# EasyEDA Pro project ProPrj_ESP32SmartClock_2025-03-27.epro

# Schematic Schematic1
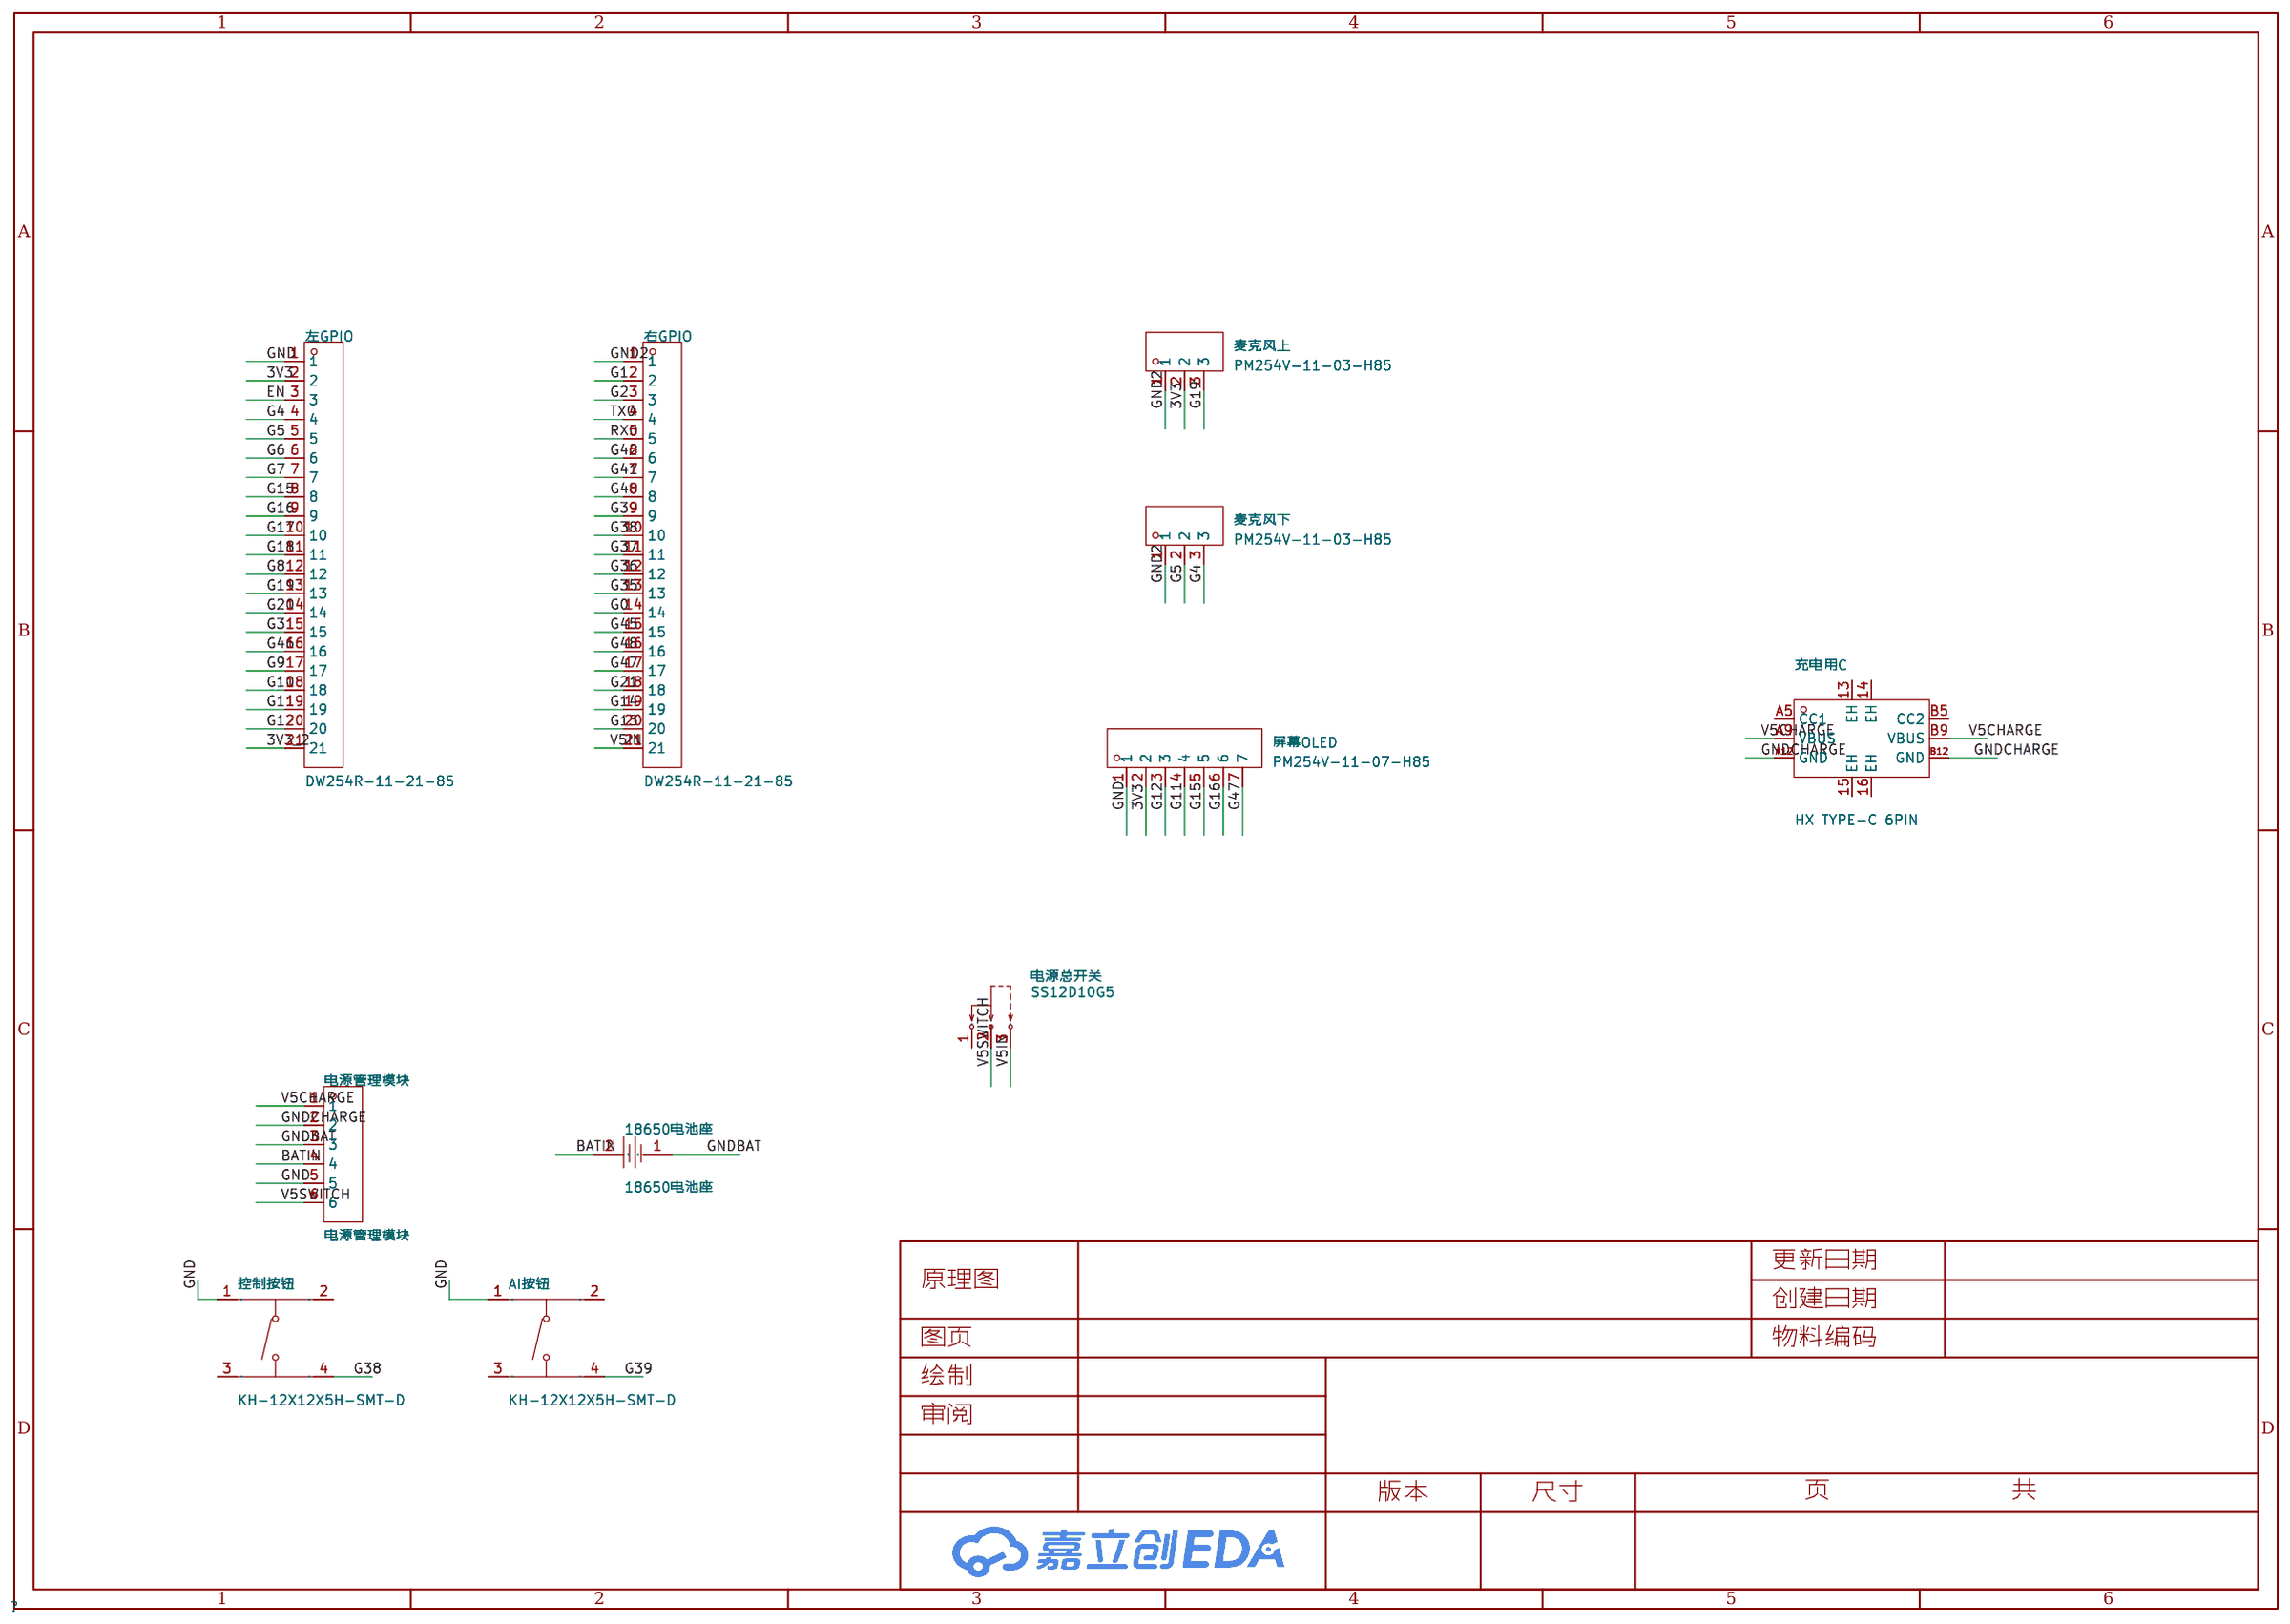
[diagram p0: schematic sheet]

## Parts
18650电池座  18650电池座  [BATTERY-SMD_18650-1S-L77.1-W20.7-1]
AI按钮  KH-12X12X5H-SMT-D  [SW-SMD_4P-L12.0-W12.0-P5.00-LS15.2]
充电用C  HX TYPE-C 6PIN  [USB-C-SMD_HX-TYPE-C-6PIN]
右GPIO  DW254R-11-21-85  [HDR-TH_21P-P2.54-V-F]
屏幕OLED  PM254V-11-07-H85  [HDR-TH_7P-P2.54-V-F]
左GPIO  DW254R-11-21-85  [HDR-TH_21P-P2.54-V-F]
控制按钮  KH-12X12X5H-SMT-D  [SW-SMD_4P-L12.0-W12.0-P5.00-LS15.2]
电源总开关  SS12D10G5  [SW-TH_SHOU-HAN_SS12D10G4]
电源管理模块  电源管理模块  [HDR-TH_6P-P2.54-V-M]
麦克风上  PM254V-11-03-H85  [HDR-TH_3P-P2.54-V-F]
麦克风下  PM254V-11-03-H85  [HDR-TH_3P-P2.54-V-F]

## Library data of the parts
18650电池座 = BH-18650-B1BA002: 连接器类型:电池盒;适用电池规格:18650;; LCSC Part Name: 电池盒 适用电池:18650; Supplier Part: C2988620; Manufacturer: MYOUNG(美阳); Supplier Footprint: SMD; JLCPCB Part Class: 扩展库; Datasheet: https://atta.szlcsc.com/upload/public/pdf/source/20220402/870DB99AB50CA0DF8D51CF7C86A51FAB.pdf; Supplier: LCSC; Connector Type: 电池盒; Battery Type: 18650
AI按钮 控制按钮 = KH-12X12X5H-SMT-D: 开关长度:12mm;开关宽度:12mm;开关高度:5mm;; LCSC Part Name: 轻触开关12*12*5 贴片耐高温环保 袋装; Supplier Part: C18186481; Manufacturer: kinghelm(金航标); Supplier Footprint: SMD,12x12mm; JLCPCB Part Class: 扩展库; Datasheet: https://atta.szlcsc.com/upload/public/pdf/source/20240419/FA690CDD48D8F1B243C62023EAFADFBA.pdf; Supplier: LCSC; Switch Length: 12mm; Switch Width: 12mm; Switch Height: 5mm
充电用C = HX TYPE-C 6PIN: 连接器类型:Type-C;公母:母;端口数量:1;触点数量:6P;安装方式:卧贴;额定电流 - 电源:3A;工作温度范围:-25℃~+85℃;; LCSC Part Name: Type-C 母 卧贴; Supplier Part: C18357552; Manufacturer: hanxia(韩下); Supplier Footprint: SMD; Datasheet: https://atta.szlcsc.com/upload/public/pdf/source/20231016/2369FEA7AA78F6601D2C568225A956AD.pdf; Supplier: LCSC; Connector Type: Type-C; Gender: 母; Number of Ports: 1; Number of Contacts: 6P; Mounting Style: 卧贴; Current Rating - Power (Max): 3A; Operating Temperature Range: -25℃~+85℃
右GPIO 左GPIO = DW254R-11-21-85: 插孔结构:1x21P;间距:2.54mm;安装类型:直插;排数:单排;; LCSC Part Name: 1x21P 间距:2.54mm 直插; Supplier Part: C7506619; Manufacturer: DEALON(德艺隆); Supplier Footprint: 插件,P=2.54mm; JLCPCB Part Class: 扩展库; Datasheet: https://atta.szlcsc.com/upload/public/pdf/source/20211231/7A8349F4557979E2F6F32A01D0D43AC4.pdf; Supplier: LCSC; Holes Structure: 1x21P; Pitch: 2.54mm; Mounting Type: 直插; Number of Rows: 单排
屏幕OLED = PM254V-11-07-H85: 插孔结构:1x7P;间距:2.54mm;行距:-;圆孔/方孔:方孔;安装类型:直插;排数:单排;总孔位数:7P;额定电流:3A;额定电压:250V;插孔方向:顶部;塑高:-;工作温度范围:-40℃~+105℃;; LCSC Part Name: 间距:2.54mm 1x7P 直插; Supplier Part: C2832270; Manufacturer: XFCN(兴飞); Supplier Footprint: 插件,P=2.54mm; JLCPCB Part Class: 扩展库; Datasheet: https://atta.szlcsc.com/upload/public/pdf/source/20210514/C2832270_F424CC0071A81298BFB56B53406F9842.pdf; Supplier: LCSC; Holes Structure: 1x7P; Pitch: 2.54mm; Circular Hole / Square Hole: 方孔; Mounting Type: 直插; Number of Rows: 单排; Number of Holes: 7P; Current Rating (Max): 3A; Voltage Rating (Max): 250V; Holes Direction: 顶部; Operating Temperature Range: -40℃~+105℃
电源总开关 = SS12D10G5: 电路结构:单刀双掷;安装方式:直插;额定电流(DC):2A;额定电压(DC):125V;机械寿命:3千次;; LCSC Part Name: 两档立式插件 3脚拨动开关 柄长5.0mm; Supplier Part: C7431054; Manufacturer: SHOU HAN(首韩); Supplier Footprint: 插件; JLCPCB Part Class: 扩展库; Datasheet: https://atta.szlcsc.com/upload/public/pdf/source/20231130/7A3DB6A149BF0A1DCFFE64FFC07FE434.pdf; Supplier: LCSC; Circuit: 单刀双掷; Switch Length: 12.7mm; Switch Width: 6.7mm; Mounting Style: 直插; Current Rating (DC): 2A; Voltage Rating (DC): 125V; Mechanical Life: 3千次; Operating Temperature: -25℃~+70℃
电源管理模块 = PZ254V-11-06P: 插针结构:1x6P;间距:2.54mm;行距:-;圆针/方针:方针;安装类型:直插;排数:单排;总PIN位数:6P;额定电流:-;额定电压:-;配合针长度:6mm;塑高:2.5mm;端接针长度:3mm;触头材质:黄铜;触头镀层:-;工作温度范围:-40℃~+105℃;颜色:黑色;; LCSC Part Name: 间距:2.54mm 1x6P 直插 方针; Supplier Part: C492405; Manufacturer: XFCN(兴飞); Supplier Footprint: 插件,P=2.54mm; JLCPCB Part Class: 扩展库; Datasheet: https://atta.szlcsc.com/upload/public/pdf/source/20200309/C492405_597F1930F5B55CC3C7FD95458F1C3977.pdf; Supplier: LCSC; Pin Structure: 1x6P; Pitch: 2.54mm; Circluar Pins/Square Pins: 方针; Mounting Type: 直插; Number of Rows: 单排; Number of Pins: 6P; Length of Mating Pin: 6mm; Insulation Height: 2.5mm; Length of End Connection Pin: 3mm; Contact Material: 黄铜; Operating Temperature Range: -40℃~+105℃; Color: 黑色
麦克风上 麦克风下 = PM254V-11-03-H85: 插孔结构:1x3P;间距:2.54mm;行距:-;安装类型:直插;排数:单排;总孔位数:3P;塑高:-;触头材质:黄铜;触头镀层:-;; LCSC Part Name: 间距:2.54mm 1x3P 直插; Supplier Part: C541850; Manufacturer: XFCN(兴飞); Supplier Footprint: 插件,P=2.54mm; JLCPCB Part Class: 扩展库; Datasheet: https://atta.szlcsc.com/upload/public/pdf/source/20200518/C541849_85853D71FC67C51915A806977A588FDA.pdf; Supplier: LCSC; Holes Structure: 1x3P; Pitch: 2.54mm; Mounting Type: 直插; Number of Rows: 单排; Number of Holes: 3P; Contact Material: 黄铜

## Nets
3V3: 屏幕OLED.2 左GPIO.2 麦克风上.2
3V3_2: 左GPIO.21
GND: AI按钮.1 屏幕OLED.1 左GPIO.1 控制按钮.1 电源管理模块.5
GND2: 右GPIO.1 麦克风上.1 麦克风下.1
GNDBAT: 18650电池座.1 电源管理模块.3
GNDCHARGE: 充电用C.A12(GND) 充电用C.B12(GND) 电源管理模块.2
V5CHARGE: 充电用C.A9(VBUS) 充电用C.B9(VBUS) 电源管理模块.1
V5IN: 右GPIO.21 电源总开关.3
V5SWITCH: 电源总开关.2 电源管理模块.6
BATIN: 18650电池座.2 电源管理模块.4
EN: 左GPIO.3
G0: 右GPIO.14
G1: 右GPIO.2
G2: 右GPIO.3
G3: 左GPIO.15
G4: 左GPIO.4 麦克风下.3
G5: 左GPIO.5 麦克风下.2
G6: 左GPIO.6
G7: 左GPIO.7
G8: 左GPIO.12
G9: 左GPIO.17
G10: 左GPIO.18
G11: 屏幕OLED.4 左GPIO.19
G12: 屏幕OLED.3 左GPIO.20
G13: 右GPIO.20
G14: 右GPIO.19
G15: 屏幕OLED.5 左GPIO.8
G16: 屏幕OLED.6 左GPIO.9
G17: 左GPIO.10
G18: 左GPIO.11
G19: 左GPIO.13 麦克风上.3
G20: 左GPIO.14
G21: 右GPIO.18
G35: 右GPIO.13
G36: 右GPIO.12
G37: 右GPIO.11
G38: 右GPIO.10 控制按钮.4
G39: AI按钮.4 右GPIO.9
G40: 右GPIO.8
G41: 右GPIO.7
G42: 右GPIO.6
G45: 右GPIO.15
G46: 左GPIO.16
G47: 右GPIO.17 屏幕OLED.7
G48: 右GPIO.16
RX0: 右GPIO.5
TX0: 右GPIO.4

Not connected (* = marked no-connect by the designer): AI按钮 2 3; 充电用C 13(EH) 14(EH) 15(EH) 16(EH) A5(CC1) B5(CC2); 控制按钮 2 3; 电源总开关 1

# Board PCB1
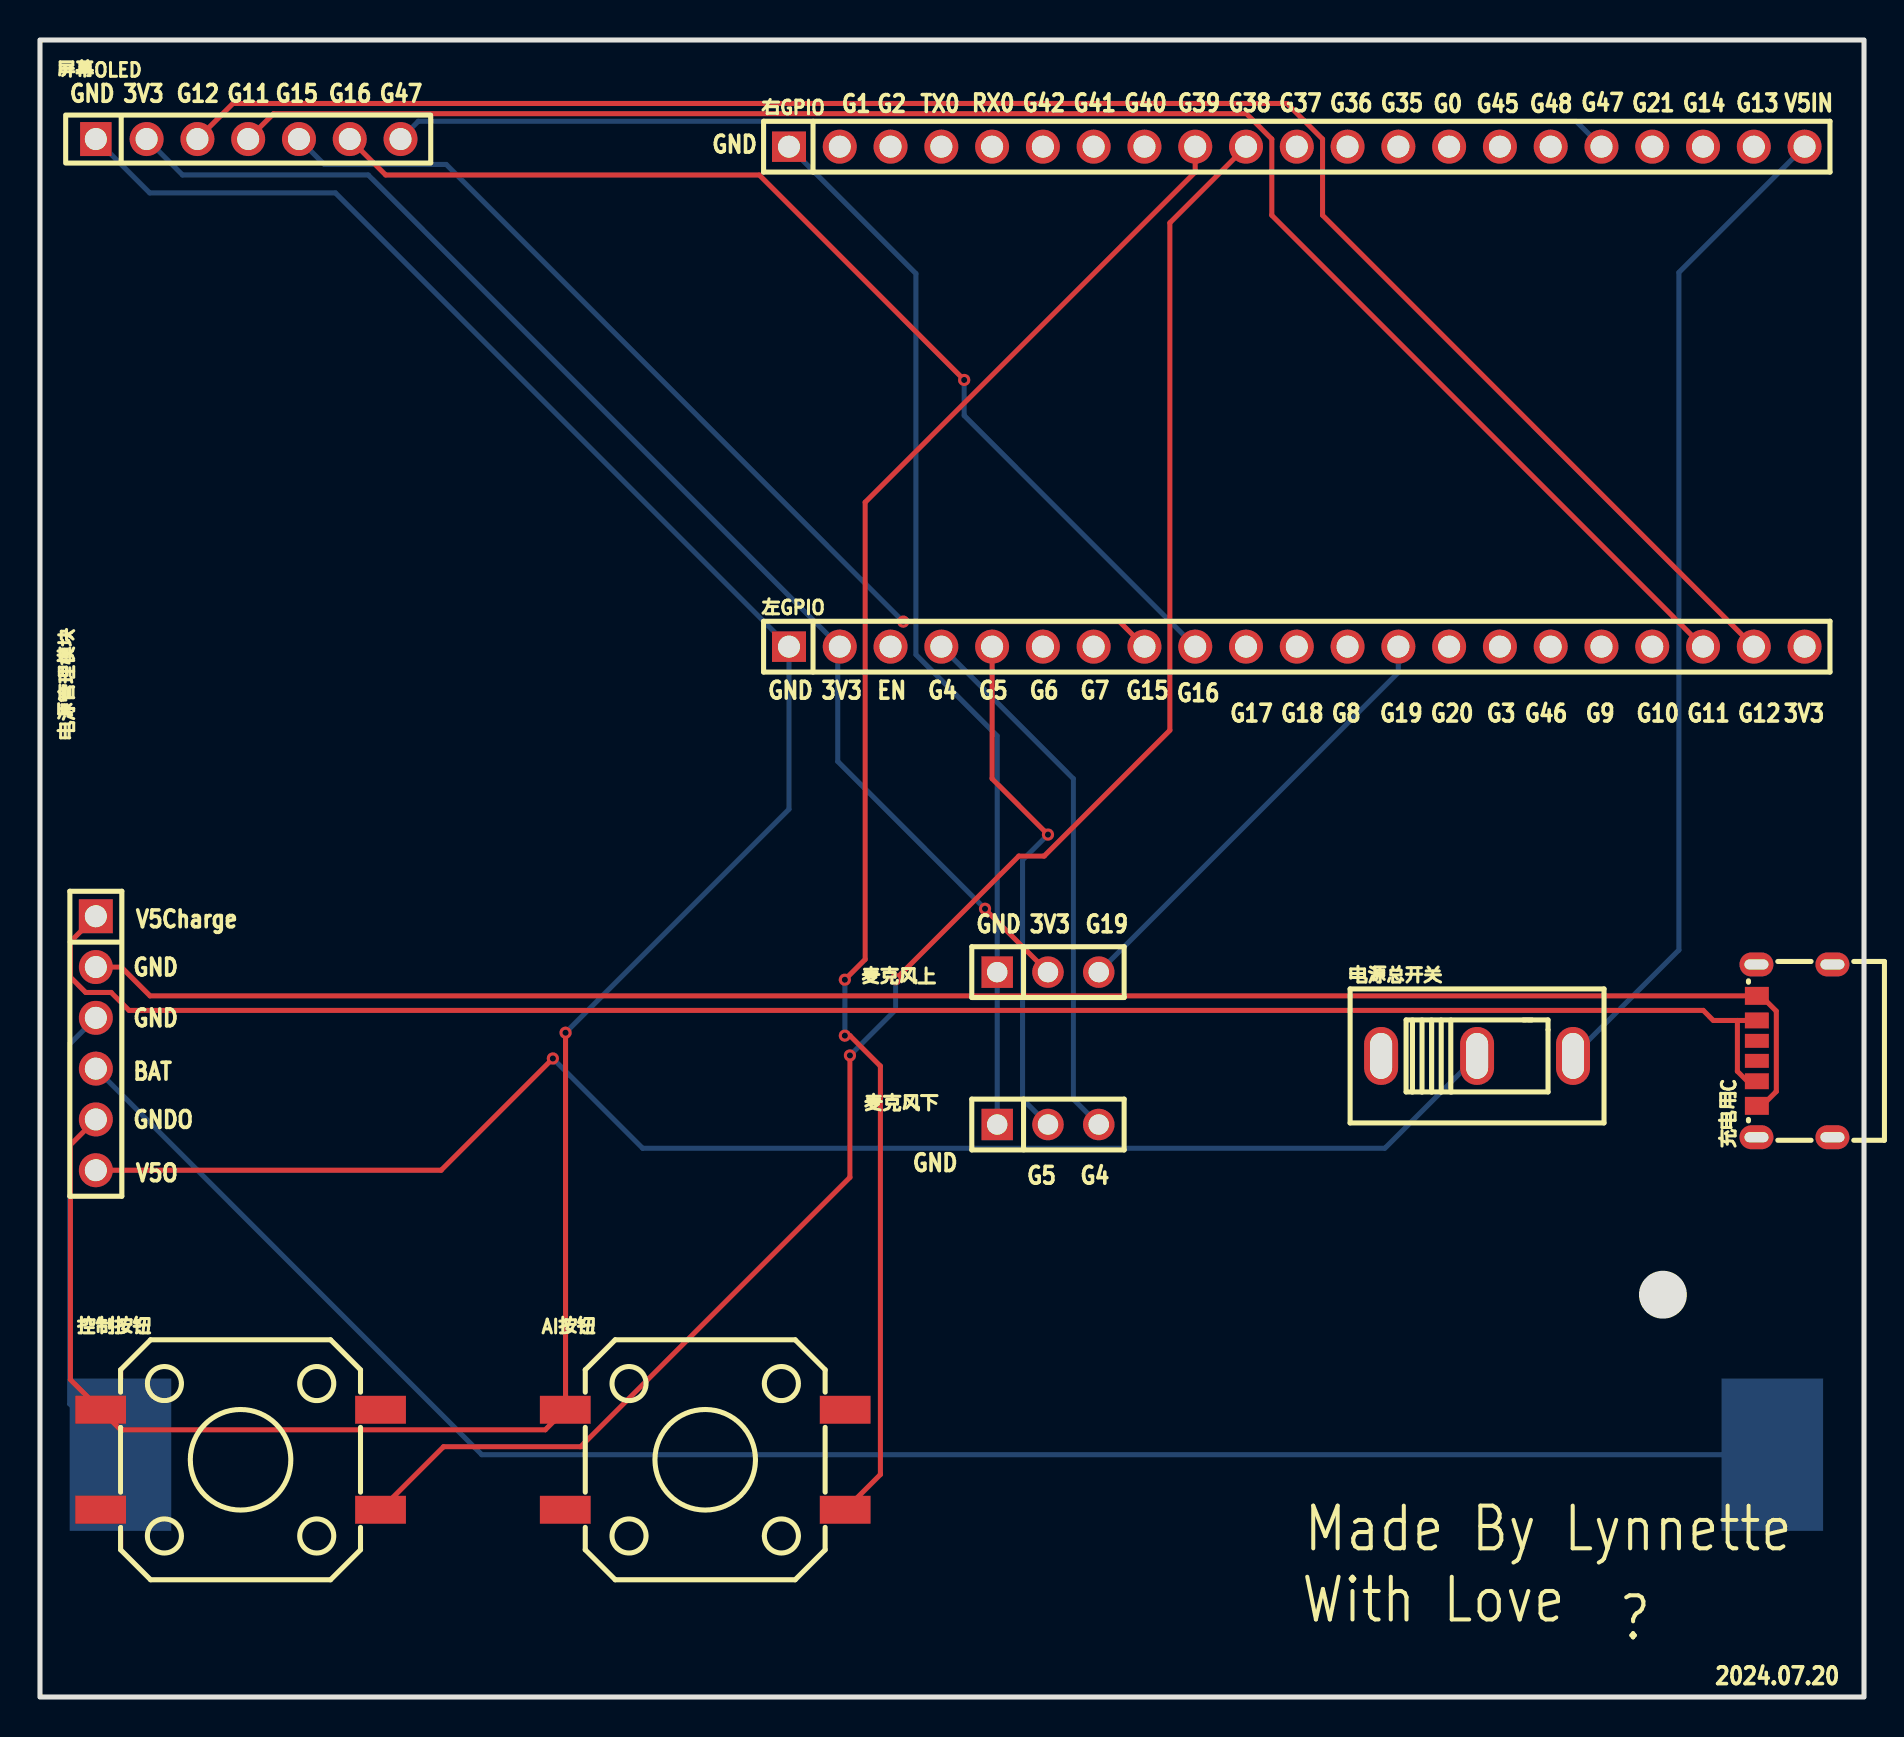
[diagram p1: board, top side]
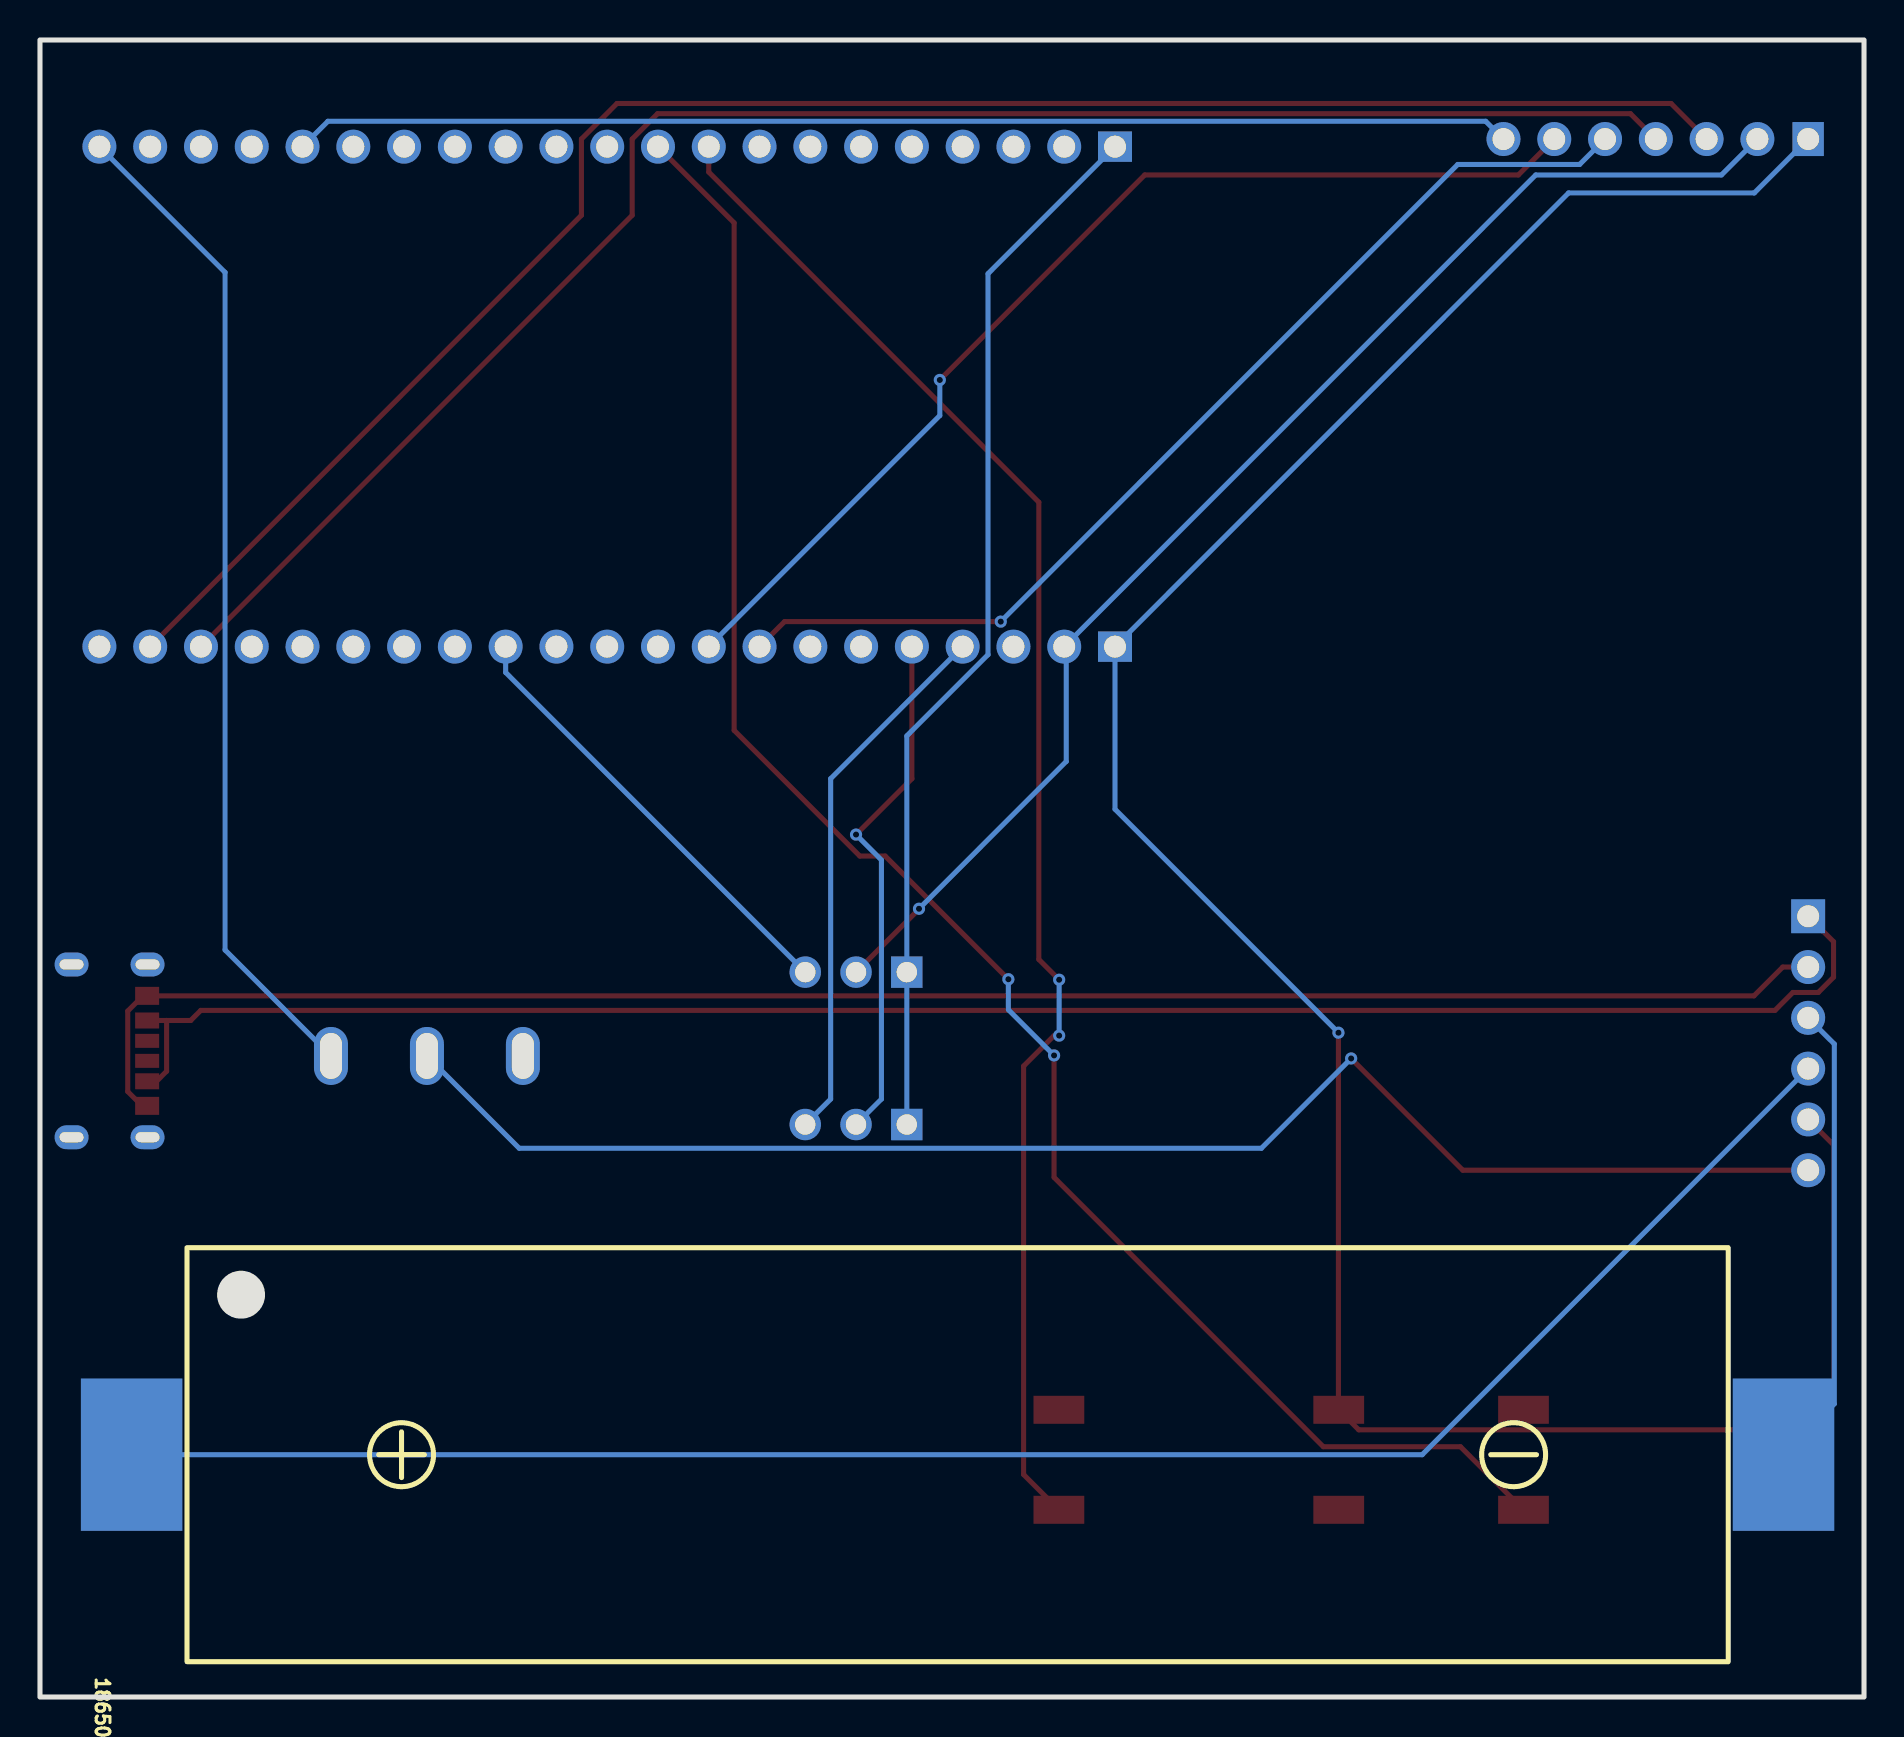
[diagram p2: board, bottom side, seen from below]

Outline 91.24 x 82.85 mm; copper layers: Top Layer, Bottom Layer. Coordinates in mm from the lower left corner of the outline.
Outline path: rectangle 0,82.85 91.24,0
Stack: Top Layer 0.035mm / Dielectric1 1.51mm FR4 er 4.5 / Bottom Layer 0.035mm

## Design rules (mm)
template: JLCPCB Capability(Two Layers Board)
spacing copperThickness1oz (default): track to track 0.102, other pairs 0.152 to 0.3
spacing copperThickness2oz: track to track 0.203, other pairs 0.152 to 0.3
track width copperThickness1oz (default): min 0.127, default 0.254, max 2.54
track width copperThickness2oz: min 0.203, default 0.254, max 2.54
differential pair differentialPair (default): width min 0.127, default 0.254, max 2.54; gap min 0.152, default 0.152
via viaSize (default): diameter min 0.5, default 0.61, max 10; hole min 0.3, default 0.305, max 6.3

## Placement (name value [footprint] x y rotation side)
18650电池座  18650电池座  [BATTERY-SMD_18650-1S-L77.1-W20.7-1]  45.34 12.12 90 bottom
AI按钮  KH-12X12X5H-SMT-D  [SW-SMD_4P-L12.0-W12.0-P5.00-LS15.2]  33.27 11.86 0 top
充电用C  HX TYPE-C 6PIN  [USB-C-SMD_HX-TYPE-C-6PIN]  87.76 32.31 90 top
右GPIO  DW254R-11-21-85  [HDR-TH_21P-P2.54-V-F]  62.86 77.52 0 top
屏幕OLED  PM254V-11-07-H85  [HDR-TH_7P-P2.54-V-F]  10.41 77.9 0 top
左GPIO  DW254R-11-21-85  [HDR-TH_21P-P2.54-V-F]  62.86 52.52 0 top
控制按钮  KH-12X12X5H-SMT-D  [SW-SMD_4P-L12.0-W12.0-P5.00-LS15.2]  10.03 11.86 0 top
电源总开关  SS12D10G5  [SW-TH_SHOU-HAN_SS12D10G4]  71.88 32.05 0 top
电源管理模块  电源管理模块  [HDR-TH_6P-P2.54-V-M]  2.79 32.69 270 top
麦克风上  PM254V-11-03-H85  [HDR-TH_3P-P2.54-V-F]  50.42 36.25 0 top
麦克风下  PM254V-11-03-H85  [HDR-TH_3P-P2.54-V-F]  50.42 28.63 0 top

## Footprints (pads in the part's own frame, mm; a bottom-side part is the same pattern mirrored in y, then rotated)
BATTERY-SMD_18650-1S-L77.1-W20.7-1
  rect 7.62x5.08 smd: 1(0,-41.313) 2(0,41.313)
HDR-TH_3P-P2.54-V-F
  rect 1.575x1.575 hole 1.02: 1(-2.54,0)
  round 1.575 hole 1.02: 2(0,0) 3(2.54,0)
HDR-TH_6P-P2.54-V-M
  rect 1.7x1.7 hole 1.1: 1(-6.35,0)
  round 1.7 hole 1.1: 2(-3.81,0) 3(-1.27,0) 4(1.27,0) 5(3.81,0) 6(6.35,0)
HDR-TH_7P-P2.54-V-F
  rect 1.575x1.7 hole 1.1: 1(-7.62,0)
  round 1.7 hole 1.1: 2(-5.08,0) 3(-2.54,0) 4(0,0) 5(2.54,0) 6(5.08,0) 7(7.62,0)
HDR-TH_21P-P2.54-V-F
  rect 1.7x1.524 hole 1.1: 1(-25.4,0)
  round 1.7 hole 1.1: 2(-22.86,0) 3(-20.32,0) 4(-17.78,0) 5(-15.24,0) 6(-12.7,0) 7(-10.16,0) 8(-7.62,0) 9(-5.08,0) 10(-2.54,0) 11(0,0) 12(2.54,0) 13(5.08,0) 14(7.62,0) 15(10.16,0) 16(12.7,0) 17(15.24,0) 18(17.78,0) 19(20.32,0) 20(22.86,0) 21(25.4,0)
SW-SMD_4P-L12.0-W12.0-P5.00-LS15.2
  rect 2.54x1.4 smd: 1(-7,2.5) 2(7,2.5) 3(-7,-2.5) 4(7,-2.5)
SW-TH_SHOU-HAN_SS12D10G4
  oval 1.7x2.9 hole 1.1x2.3: 1(-4.8,0) 2(0,0) 3(4.8,0)
USB-C-SMD_HX-TYPE-C-6PIN
  oval 1.2x1.7 hole 0.5x1.2: 13(-4.32,1.9) 14(4.32,1.9) 15(-4.32,-1.9) 16(4.32,-1.9)
  rect 0.7x1.2 smd: A5(-0.5,1.88) B5(0.5,1.88)
  rect 0.8x1.2 smd: A9(1.52,1.88) B9(-1.52,1.88)
  rect 0.9x1.2 smd: A12(2.75,1.88) B12(-2.75,1.88)

## Nets
As in the schematic.

Pads without a net: AI按钮 2 3; 充电用C 13 14 15 16 A5 B5; 控制按钮 2 3; 电源总开关 1

## Via types
v1: diameter 0.61, hole 0.305, Top Layer to Bottom Layer, 10 vias

## Routing (per net, layer and track width the routed paths; a pad name or vN(x,y) marks a point on that pad's centre or on a via; arc(x,y) is an arc through that point)
3V3: length 65.9
  Top Layer w0.254: 麦克风上.2 47.27,39.4 v1(47.27,39.41)
  Bottom Layer w0.254: 39.9,52.62 40.01,52.52 ; 39.9,52.62 39.9,46.78 v1(47.27,39.41) ; 39.9,52.62 16.42,76.11 7.13,76.11 屏幕OLED.2
GND: length 127.7
  Top Layer w0.254: v1(26.29,33.22) 26.29,14.38 AI按钮.1 25.27,13.36 4.03,13.36 控制按钮.1 1.52,15.87 1.52,27.61 电源管理模块.5
  Bottom Layer w0.254: v1(26.29,33.22) 37.47,44.39 37.47,52.52 14.78,75.21 5.49,75.21 屏幕OLED.1
GND2: length 53.2
  Bottom Layer w0.254: 麦克风下.1 麦克风上.1 47.88,48.06 43.82,52.12 43.82,71.17 37.47,77.52
GNDBAT: length 23.4
  Bottom Layer w0.254: 电源管理模块.3 1.49,32.65 1.49,14.66 18650电池座.1
GNDCHARGE: length 90.3
  Top Layer w0.254: 电源管理模块.2 4.06,36.5 5.51,35.06 充电用C.A12 86.09,35.06 86.85,34.3 86.85,30.28 86.13,29.56 充电用C.B12
V5CHARGE: length 92.5
  Top Layer w0.254: 84.9,33.83 83.7,33.83 83.19,34.33 4.45,34.33 3.56,35.23 2.29,35.23 1.52,35.99 1.52,37.77 电源管理模块.1 ; 84.9,33.83 充电用C.A9 ; 84.9,33.83 84.9,31.29 85.4,30.79 充电用C.B9
V5IN: length 50.3
  Bottom Layer w0.254: 右GPIO.21 81.98,71.23 81.98,37.35 电源总开关.3
V5SWITCH: length 75.2
  Top Layer w0.254: 电源管理模块.6 20.07,26.34 v1(25.65,31.93)
  Bottom Layer w0.254: v1(25.65,31.93) 30.14,27.44 67.27,27.44 电源总开关.2
BATIN: length 91.9
  Bottom Layer w0.254: 18650电池座.2 22.1,12.12 电源管理模块.4
G4: length 27.2
  Bottom Layer w0.254: 左GPIO.4 51.69,45.92 51.69,29.9 麦克风下.3
G5: length 26.1
  Top Layer w0.254: 47.63,52.52 47.63,45.92 v1(50.42,43.12)
  Bottom Layer w0.254: 麦克风下.2 49.15,29.9 49.15,41.85 v1(50.42,43.12)
G11: length 86.6
  Top Layer w0.254: 屏幕OLED.4 11.68,79.17 60.34,79.17 61.61,77.9 61.61,74.09 83.19,52.52
G12: length 92.1
  Top Layer w0.254: 左GPIO.20 64.15,74.09 64.15,77.9 62.38,79.68 9.65,79.68 屏幕OLED.3
G15: length 52.8
  Top Layer w0.254: 左GPIO.8 53.99,53.77 v1(43.18,53.77)
  Bottom Layer w0.254: 屏幕OLED.5 14.22,76.63 20.32,76.63 v1(43.18,53.77)
G16: length 53.8
  Top Layer w0.254: 屏幕OLED.6 17.29,76.11 35.98,76.11 v1(46.23,65.86)
  Bottom Layer w0.254: v1(46.23,65.86) 46.23,64.08 57.79,52.52
G19: length 22.5
  Bottom Layer w0.254: 麦克风上.3 67.95,51.23 左GPIO.13
G38: length 90.9
  Top Layer w0.254: v1(42.8,35.89) 48.96,42.05 50.23,42.05 56.52,48.34 56.52,73.71 右GPIO.10 ; 控制按钮.4 20.18,12.51 27.04,12.51 40.51,25.98 v1(40.51,32.08)
  Bottom Layer w0.254: v1(40.51,32.08) 42.8,34.37 v1(42.8,35.89)
G39: length 77
  Top Layer w0.254: AI按钮.4 42.04,11.12 42.04,31.55 40.51,33.07 v1(40.26,33.07) ; v1(40.26,35.86) 41.27,36.88 41.27,59.74 57.79,76.25 57.79,77.52
  Bottom Layer w0.254: v1(40.26,35.86) v1(40.26,33.07)
G47: length 61
  Bottom Layer w0.254: 右GPIO.17 76.83,78.79 18.92,78.79 屏幕OLED.7

## Text on the board
Top Silkscreen Layer: GND | 3V3 | BAT | GNDO | V5Charge | V5O | G12 | G11 | G15 | G16 | G47 | G1 | G2 | EN | TX0 | G4 | RX0 | G5 | G42 | G6 | G41 | G7 | G19 | G40 | G39 | G38 | G17 | G37 | G18 | G36 | G8 | G35 | G20 | G0 | G45 | G3 | G46 | G48 | G9 | G21 | G10 | G14 | 2024.07.20 | G13 | V5IN | With Love | Made By Lynnette | 💗
